# EAGLE design Keg Cop - Devel TH (EAGLE 9.6.2)
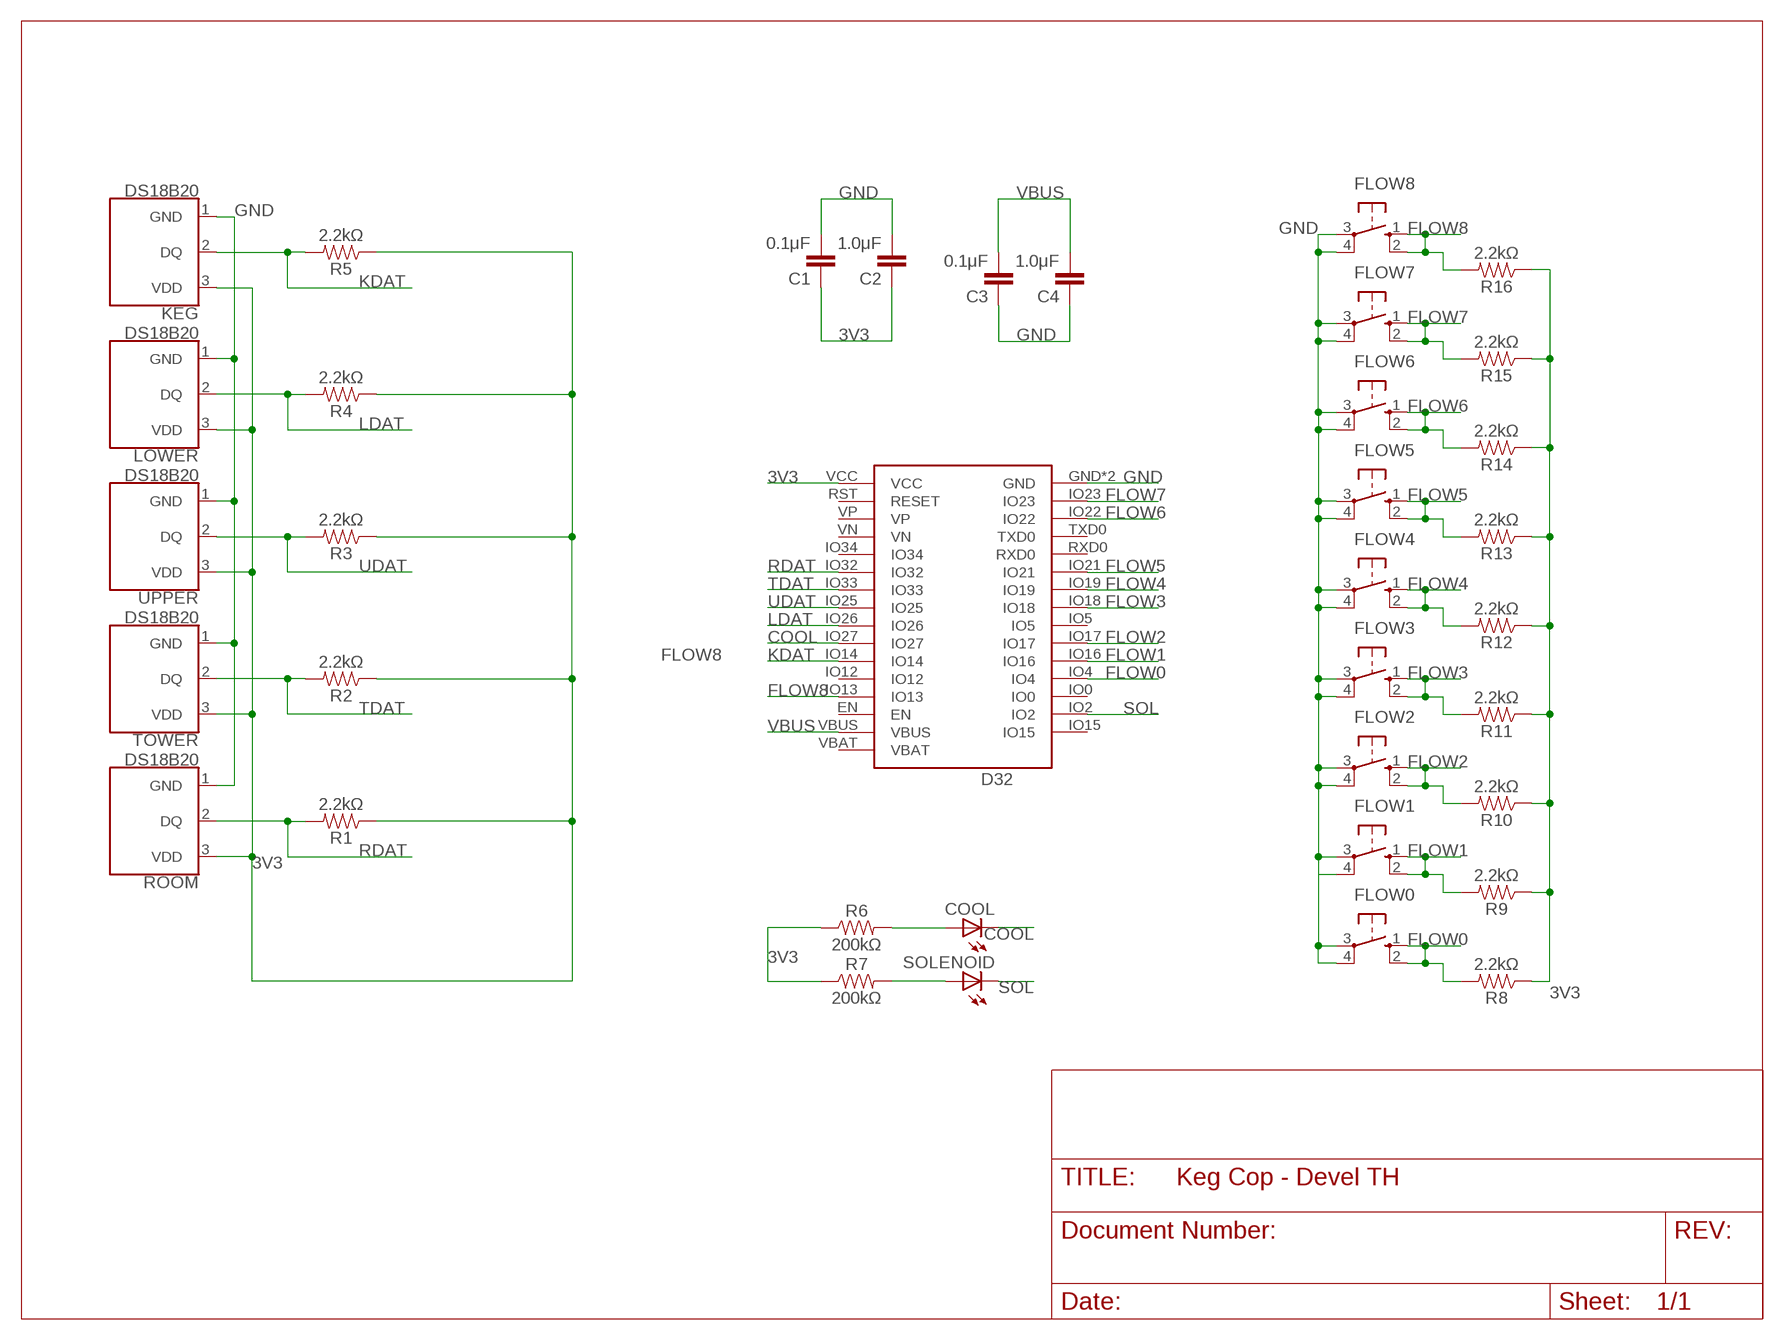
[diagram p0: schematic, sheet 1]

## Parts
C1  0.1μF  CAP_CERAMIC_2.54  [CAP_PTH-2.54]
C2  1.0μF  CAP_CERAMIC_2.54  [CAP_PTH-2.54]
C3  0.1μF  CAP_CERAMIC_2.54  [CAP_PTH-2.54]
C4  1.0μF  CAP_CERAMIC_2.54  [CAP_PTH-2.54]
COOL  LED3MM  [LED3MM]
D32  Lolin D32  WEMOS-D32D32_NO_BATT  [D32_NO_BATT]
FLOW0  10-XX  [B3F-10XX]
FLOW1  10-XX  [B3F-10XX]
FLOW2  10-XX  [B3F-10XX]
FLOW3  10-XX  [B3F-10XX]
FLOW4  10-XX  [B3F-10XX]
FLOW5  10-XX  [B3F-10XX]
FLOW6  10-XX  [B3F-10XX]
FLOW7  10-XX  [B3F-10XX]
FLOW8  10-XX  [B3F-10XX]
KEG  DS18B20  [TO-92-AMMO]
LOWER  DS18B20  [TO-92-AMMO]
R1  2.2kΩ  RESISTORAXIAL-0.3  [AXIAL-0.3]
R2  2.2kΩ  RESISTORAXIAL-0.3  [AXIAL-0.3]
R3  2.2kΩ  RESISTORAXIAL-0.3  [AXIAL-0.3]
R4  2.2kΩ  RESISTORAXIAL-0.3  [AXIAL-0.3]
R5  2.2kΩ  RESISTORAXIAL-0.3  [AXIAL-0.3]
R6  200kΩ  RESISTORAXIAL-0.3  [AXIAL-0.3]
R7  200kΩ  RESISTORAXIAL-0.3  [AXIAL-0.3]
R8  2.2kΩ  RESISTORAXIAL-0.3  [AXIAL-0.3]
R9  2.2kΩ  RESISTORAXIAL-0.3  [AXIAL-0.3]
R10  2.2kΩ  RESISTORAXIAL-0.3  [AXIAL-0.3]
R11  2.2kΩ  RESISTORAXIAL-0.3  [AXIAL-0.3]
R12  2.2kΩ  RESISTORAXIAL-0.3  [AXIAL-0.3]
R13  2.2kΩ  RESISTORAXIAL-0.3  [AXIAL-0.3]
R14  2.2kΩ  RESISTORAXIAL-0.3  [AXIAL-0.3]
R15  2.2kΩ  RESISTORAXIAL-0.3  [AXIAL-0.3]
R16  2.2kΩ  RESISTORAXIAL-0.3  [AXIAL-0.3]
ROOM  DS18B20  [TO-92-AMMO]
SOLENOID  LED3MM  [LED3MM]
TOWER  DS18B20  [TO-92-AMMO]
UPPER  DS18B20  [TO-92-AMMO]

## Nets
3V3 [3v]: C1.1 C2.1 D32.VCC KEG.3(VDD) LOWER.3(VDD) R1.P$1 R2.P$1 R3.P$1 R4.P$1 R5.P$1 R6.P$1 R7.P$1 R8.P$1 R9.P$1 R10.P$1 R11.P$1 R12.P$1 R13.P$1 R14.P$1 R15.P$1 R16.P$1 ROOM.3(VDD) TOWER.3(VDD) UPPER.3(VDD)
COOL: COOL.K(C) D32.IO27
FLOW0: D32.IO4 FLOW0.1(S) FLOW0.2(S1) R8.P$2
FLOW1: D32.IO16 FLOW1.1(S) FLOW1.2(S1) R9.P$2
FLOW2: D32.IO17 FLOW2.1(S) FLOW2.2(S1) R10.P$2
FLOW3: D32.IO18 FLOW3.1(S) FLOW3.2(S1) R11.P$2
FLOW4: D32.IO19 FLOW4.1(S) FLOW4.2(S1) R12.P$2
FLOW5: D32.IO21 FLOW5.1(S) FLOW5.2(S1) R13.P$2
FLOW6: D32.IO22 FLOW6.1(S) FLOW6.2(S1) R14.P$2
FLOW7: D32.IO23 FLOW7.1(S) FLOW7.2(S1) R15.P$2
FLOW8: D32.IO13 FLOW8.1(S) FLOW8.2(S1) R16.P$2
GND: C1.2 C2.2 C3.1 C4.1 D32.GND D32.GND2(GND) FLOW0.3(P) FLOW0.4(P1) FLOW1.3(P) FLOW1.4(P1) FLOW2.3(P) FLOW2.4(P1) FLOW3.3(P) FLOW3.4(P1) FLOW4.3(P) FLOW4.4(P1) FLOW5.3(P) FLOW5.4(P1) FLOW6.3(P) FLOW6.4(P1) FLOW7.3(P) FLOW7.4(P1) FLOW8.3(P) FLOW8.4(P1) KEG.1(GND) LOWER.1(GND) ROOM.1(GND) TOWER.1(GND) UPPER.1(GND)
KDAT: D32.IO14 KEG.2(DQ) R5.P$2
LDAT: D32.IO26 LOWER.2(DQ) R4.P$2
N$1: COOL.A R6.P$2
N$2: R7.P$2 SOLENOID.A
RDAT: D32.IO32 R1.P$2 ROOM.2(DQ)
SOL: D32.IO2 SOLENOID.K(C)
TDAT: D32.IO33 R2.P$2 TOWER.2(DQ)
UDAT: D32.IO25 R3.P$2 UPPER.2(DQ)
VBUS: C3.2 C4.2 D32.VBUS
Unconnected: D32.EN D32.IO0 D32.IO5 D32.IO12 D32.IO15 D32.IO34 D32.RST(RESET) D32.RXD0 D32.TXD0 D32.VBAT D32.VN D32.VP

## Library data of the parts
C1-C4 = Donnie:CAP_CERAMIC_2.54
COOL SOLENOID = adafruit:LED: LED OSRAM: - CHIPLED LG R971, LG N971, LY N971, LG Q971, LY Q971, LO R971, LY R971 LH N974, LH R974 LS Q976, LO Q976, LY Q976 LO Q996 - Hyper CHIPLED LW Q18S LB Q993, LB Q99A, LB R99A - SideLED LS A670, LO A670, LY A670, LG A670, LP A670 LB A673, LV A673, LT A673, LW A673 LH A674 LY A675 LS A676, LA A676, LO A676, LY A676, LW A676 LS A679, LY A679, LG A679 - Hyper Micro SIDELED® LS Y876, LA Y876, LO Y876, LY Y876 LT Y87S - SmartLED LW L88C, LW L88S LB L89C, LB L89S, LG L890 LS L89K, LO L89K, LY L89K LS L896, LA L896, LO L896, LY L896 - TOPLED LS T670, LO T670, LY T670, LG T670, LP T670 LSG T670, LSP T670, LSY T670, LOP T670, LYG T670 LG T671, LOG T671, LSG T671 LB T673, LV T673, LT T673, LW T673 LH T674 LS T676, LA T676, LO T676, LY T676, LB T676, LH T676, LSB T676, LW T676 LB T67C, LV T67C, LT T67C, LS T67K, LO T67K, LY T67K, LW E67C LS E67B, LA E67B, LO E67B, LY E67B, LB E67C, LV E67C, LT E67C LW T67C LS T679, LY T679, LG T679 LS T770, LO T770, LY T770, LG T770, LP T770 LB T773, LV T773, LT T773, LW T773 LH T774 LS E675, LA E675, LY E675, LS T675 LS T776, LA T776, LO T776, LY T776, LB T776 LHGB T686 LT T68C, LB T68C - Hyper Mini TOPLED® LB M676 - Mini TOPLED Santana® LG M470 LS M47K, LO M47K, LY M47K Source: http://www.osram.convergy.de/
D32 = Donnie:WEMOS-D32: D32_REVERSE is a Reverse silkscreen for placing the Wemos D32 on the underside of the board D32_NO-KEEPOUT removes the keepout area beneath the antenna on the D32 and provides a note to avoid components and traces.; SPICEPREFIX: X
FLOW0 FLOW1-FLOW8 = switch-omron:10-XX: OMRON SWITCH; MPN: B3F-1000; OC_FARNELL: 176432; OC_NEWARK: 36M3542
KEG LOWER ROOM TOWER UPPER = SparkFun-Sensors:DS18B20: Dallas/Maxim DS18B20 1-Wire Temperature Sensor The DS18B20 reports degrees C with 9 to 12-bit precision, -55C to 125C (+/-0.5C). Each sensor has a unique 64-Bit Serial number etched into it - allows for a huge number of sensors to be used on one data bus. Datasheet <http://datasheets.maximintegrated.com/en/ds/DS18B20.pdf> SparkFun Products One Wire Digital Temperature Sensor - DS18B20 <https://www.sparkfun.com/products/245> (SEN-00245); STORE_ID: SEN-00245
R1-R16 = SparkFun-Resistors:RESISTOR: Generic Resistor Package

## Net classes
0 default: width 0.305 mm, clearance 0.305 mm
1 5v: width 0.406 mm, clearance 0.406 mm
2 3v: width 0.406 mm, clearance 0.406 mm

## Board
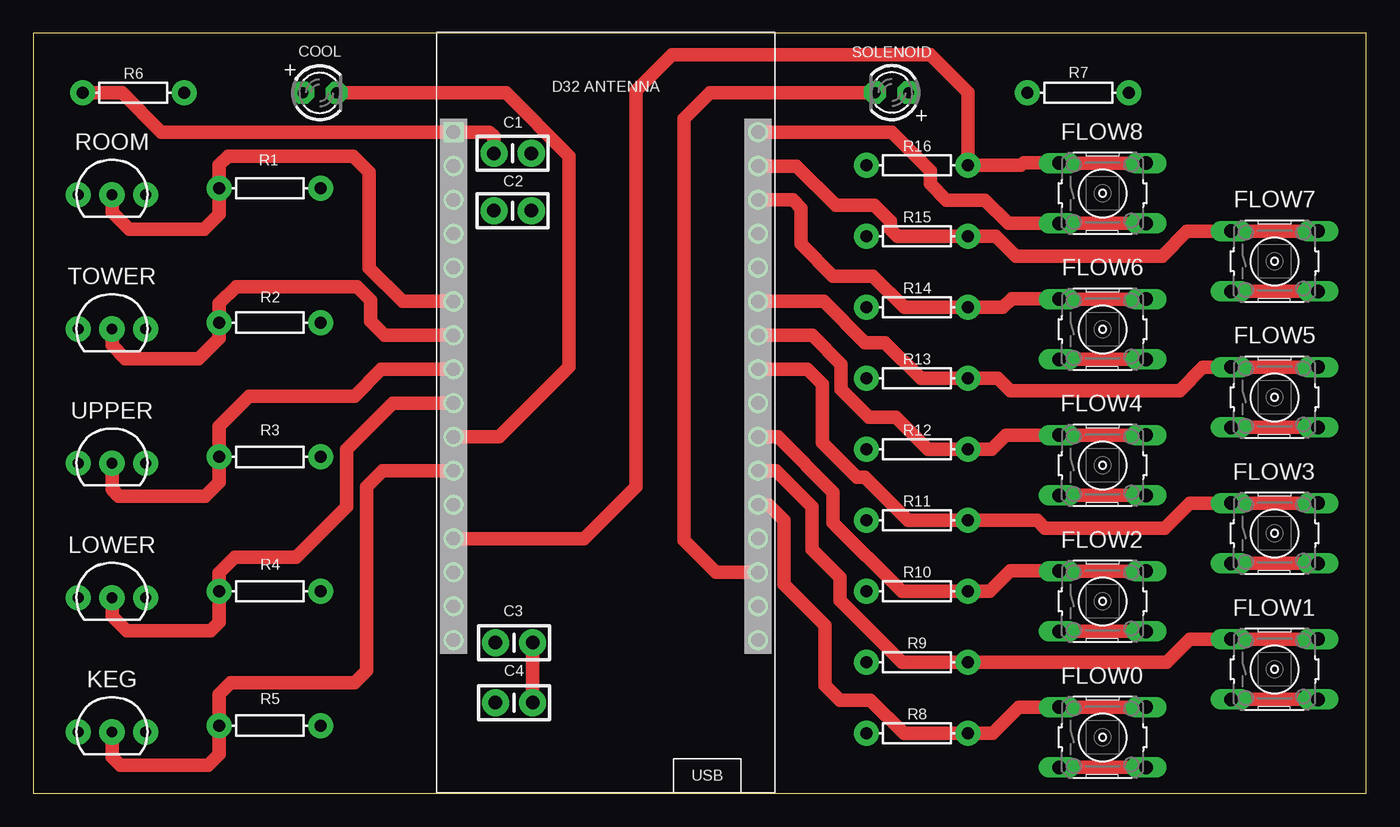
[diagram p1: board, top side]
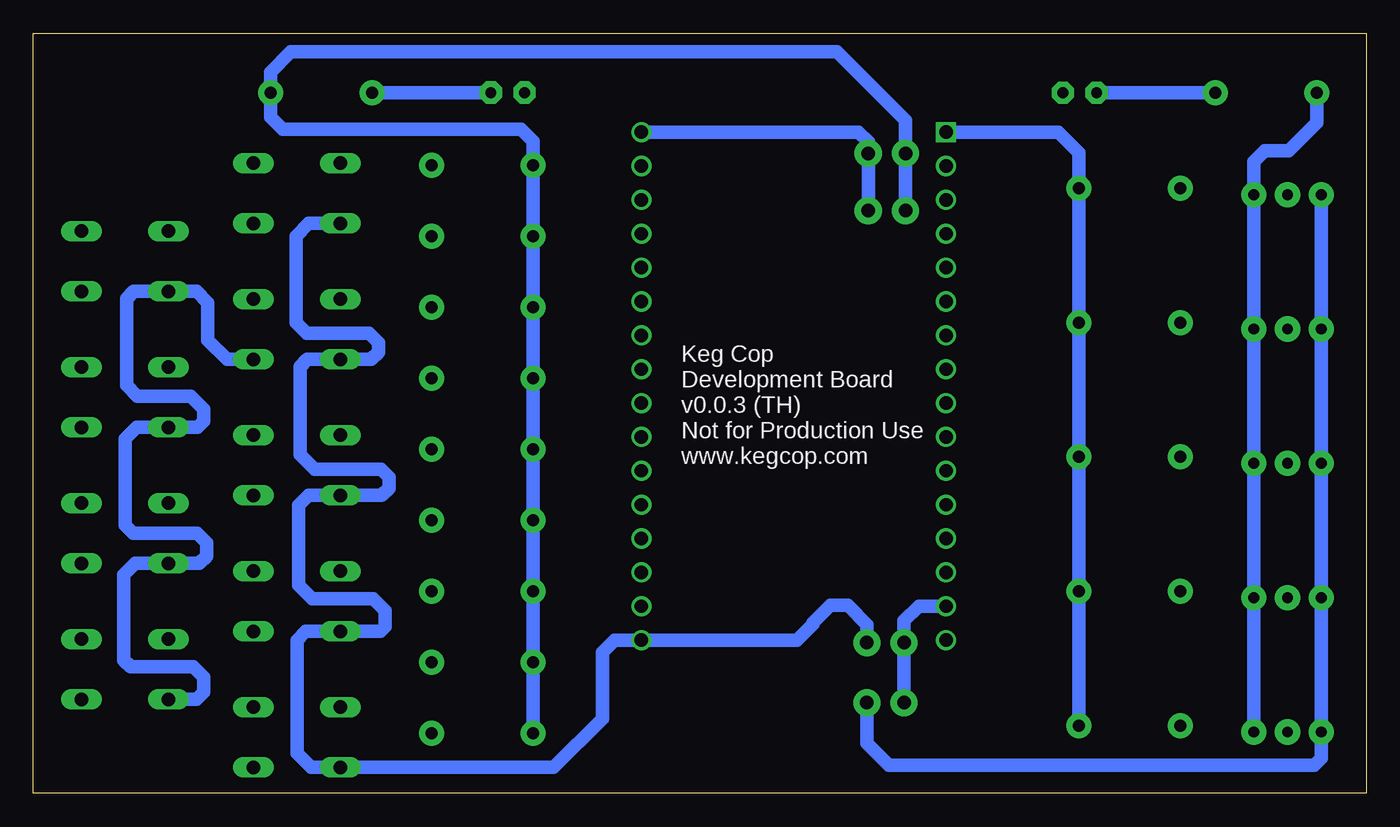
[diagram p2: board, bottom side, seen from below]

Size 100 x 57 mm. Coordinates in mm from the lower left corner, seen from the top.
Outline: 0,0 100,0 100,57 0,57 0,0
Copper layers (1*16): Top 0.035mm / dielectric 1.5mm / Bottom 0.035mm
Design rules "default *": minimum track width 6mil, minimum drill 0.35mm, track to track 6mil, track to pad 6mil, pad to pad 6mil, via to via 6mil, smd to smd 6mil, copper to edge 20mil, drill to drill 6mil, minimum pad ring 10mil, minimum via ring 8mil, stop-mask expansion 4mil, vias tented up to drill 20mil, thermal gap 10mil

### Footprints (pad centres in the part's own frame; a part is rotated, then mirrored left to right if it is on the bottom)
CAP_PTH-2.54 = drill 1.016 pad 2.032: 1 -1.397,0; 2 1.397,0
LED3MM = drill 0.813 pad 1.676 octagon: A -1.27,0; K 1.27,0
D32_NO_BATT = drill 1: EN -11.43,-12.7; GND 11.43,20.32; GND2 11.43,-17.78; IO0 11.43,-10.16; IO2 11.43,-12.7; IO4 11.43,-7.62; IO5 11.43,0; IO12 -11.43,-7.62; IO13 -11.43,-10.16; IO14 -11.43,-5.08; IO15 11.43,-15.24; IO16 11.43,-5.08; IO17 11.43,-2.54; IO18 11.43,2.54; IO19 11.43,5.08; IO21 11.43,7.62; IO22 11.43,15.24; IO23 11.43,17.78; IO25 -11.43,2.54; IO26 -11.43,0; IO27 -11.43,-2.54; IO32 -11.43,7.62; IO33 -11.43,5.08; IO34 -11.43,10.16; RST -11.43,17.78; RXD0 11.43,10.16; TXD0 11.43,12.7; VBAT -11.43,-17.78; VBUS -11.43,-15.24; VN -11.43,12.7; VP -11.43,15.24 | drill 1 square: VCC -11.43,20.32
B3F-10XX = drill 1.016 long: 1 -3.251,2.261; 2 3.251,2.261; 3 -3.251,-2.261; 4 3.251,-2.261
TO-92-AMMO = drill 0.813 pad 1.88: 1 -2.54,0; 2 0,0; 3 2.54,0
AXIAL-0.3 = drill 0.9 pad 1.88: P$1 -3.81,0; P$2 3.81,0

### Placement (x,y rotation side)
C1  35.96,48 0 top
C2  35.96,43.7 0 top
C3  36.06,11.3 180 top
C4  36.06,6.8 180 top
COOL  21.49,52.54 0 top
D32  42.95,29.27 0 top
FLOW0  80.22,4.2 0 top
FLOW1  93.12,9.3 0 top
FLOW2  80.22,14.4 0 top
FLOW3  93.12,19.5 0 top
FLOW4  80.22,24.6 0 top
FLOW5  93.12,29.7 0 top
FLOW6  80.22,34.8 0 top
FLOW7  93.12,39.9 0 top
FLOW8  80.22,45 0 top
KEG  5.9,4.6 0 top
LOWER  5.9,14.68 0 top
R1  17.75,45.38 180 top
R2  17.75,35.3 180 top
R3  17.75,25.23 180 top
R4  17.75,15.15 180 top
R5  17.75,5.08 180 top
R6  7.5,52.55 0 top
R7  78.4,52.55 180 top
R8  66.3,4.5 0 top
R9  66.3,9.82 0 top
R10  66.3,15.15 0 top
R11  66.3,20.48 0 top
R12  66.3,25.8 0 top
R13  66.3,31.12 0 top
R14  66.3,36.45 0 top
R15  66.3,41.77 0 top
R16  66.3,47.1 0 top
ROOM  5.9,44.9 0 top
SOLENOID  64.41,52.56 180 top
TOWER  5.9,34.83 0 top
UPPER  5.9,24.75 0 top

### Tracks (layer width: path | path; a pad name or v marks a point on that pad's centre or on a via)
3V3
  Top 1.016: R6.P$1 6.65,52.55 9.61,49.59 D32.VCC 34.21,49.59 34.57,49.23 C1.1
  Bottom 1.016: KEG.3 LOWER.3 UPPER.3 TOWER.3 ROOM.3 8.44,47.36 7.6,48.2 5.8,48.2 3.69,50.31 R6.P$1 | R5.P$1 R4.P$1 R3.P$1 R2.P$1 R1.P$1 21.56,48.06 23.09,49.59 D32.VCC | R8.P$1 R9.P$1 R10.P$1 R11.P$1 R12.P$1 R13.P$1 R14.P$1 R15.P$1 R16.P$1 62.49,48.89 63.4,49.8 81.3,49.8 82.21,50.71 R7.P$1 82.21,54.09 80.7,55.6 39.7,55.6 34.57,50.47 C1.1 C2.1
COOL
  Top 1.016: D32.IO27 34.93,26.73 40.2,32 40.2,47.8 35.46,52.54 COOL.K
FLOW0
  Top 1.016: D32.IO4 55.15,21.65 56.3,20.5 56.3,15.7 59.4,12.6 59.4,8.1 60.5,7 62.8,7 65.3,4.5 R8.P$2 72,4.5 73.96,6.46 FLOW0.1 FLOW0.2
FLOW1
  Top 1.016: D32.IO16 55.71,24.19 58.4,21.5 58.4,18.3 60.5,16.2 60.5,14.5 65.17,9.82 R9.P$2 85.03,9.82 86.76,11.56 FLOW1.1 FLOW1.2
FLOW2
  Top 1.016: D32.IO17 55.86,26.73 60,22.59 60,20.3 65.15,15.15 R10.P$2 71.75,15.15 73.3,16.7 76.93,16.7 FLOW2.1 FLOW2.2
FLOW3
  Top 1.016: D32.IO18 58.09,31.81 59.2,30.7 59.2,26.3 61.8,23.7 62.4,23.7 65.62,20.48 R11.P$2 75.33,20.48 75.9,19.9 84.9,19.9 86.76,21.76 FLOW3.1 FLOW3.2
FLOW4
  Top 1.016: D32.IO19 58.45,34.35 60.6,32.2 60.6,30.3 62.7,28.2 64.7,28.2 67.1,25.8 R12.P$2 71.9,25.8 72.96,26.86 FLOW4.1 FLOW4.2
FLOW5
  Top 1.016: D32.IO21 59.31,36.89 62.4,33.8 63.9,33.8 66.58,31.12 R13.P$2 72.38,31.12 73.3,30.2 86,30.2 87.76,31.96 FLOW5.1 FLOW5.2
FLOW6
  Top 1.016: D32.IO22 56.99,44.51 57.6,43.9 57.6,41.2 60,38.8 63,38.8 65.35,36.45 R14.P$2 72.75,36.45 73.4,37.1 76.93,37.1 FLOW6.1 FLOW6.2
FLOW7
  Top 1.016: D32.IO23 57.25,47.05 60.2,44.1 63.1,44.1 64.3,42.9 64.3,42.3 64.83,41.77 R15.P$2 72.22,41.77 73.7,40.3 84.7,40.3 86.56,42.16 FLOW7.1 FLOW7.2
FLOW8
  Top 1.016: D32.IO13 41.31,19.11 45.2,23 45.2,52.7 47.9,55.4 67.3,55.4 70.11,52.59 R16.P$2 74.1,47.1 74.3,47.3 76.93,47.3 FLOW8.1 FLOW8.2
GND
  Top 1.016: FLOW8.4 FLOW8.3 73.16,42.74 71.4,44.5 68.5,44.5 67.3,45.7 67.3,46.7 64.41,49.59 D32.GND | FLOW6.3 FLOW6.4 | FLOW4.3 FLOW4.4 | FLOW2.3 FLOW2.4 | FLOW0.3 FLOW0.4 | FLOW1.3 FLOW1.4 | FLOW3.3 FLOW3.4 | FLOW5.3 FLOW5.4 | FLOW7.3 FLOW7.4 | C4.1 C3.1
  Bottom 1.016: ROOM.1 TOWER.1 UPPER.1 LOWER.1 KEG.1 3.36,2.64 3.9,2.1 34.4,2.1 35.8,2.1 37.46,3.76 C4.1 | FLOW8.3 79.36,42.74 80.3,41.8 80.3,35.3 79.5,34.5 74.8,34.5 74.1,33.8 74.1,33.1 74.66,32.54 FLOW6.3 79.46,32.54 80,32 80,25.4 78.9,24.3 73.9,24.3 73.3,23.7 73.3,22.9 73.86,22.34 FLOW4.3 79.36,22.34 80.1,21.6 80.1,15.6 79.1,14.6 74.5,14.6 73.6,13.7 73.6,12.5 73.96,12.14 FLOW2.3 79.56,12.14 80.2,11.5 80.2,3 79.14,1.94 FLOW0.3 60.96,1.94 57.3,5.6 57.3,10.6 56.41,11.49 D32.GND2 42.71,11.49 41.5,12.7 41.5,12.8 40.2,14.1 38.9,14.1 37.46,12.66 C3.1 | FLOW1.3 87.76,7.04 87.2,7.6 87.2,8.7 88,9.5 92.7,9.5 93.2,10 93.2,16.4 92.36,17.24 FLOW3.3 87.56,17.24 87,17.8 87,18.8 87.7,19.5 92.5,19.5 93.1,20.1 93.1,26.6 92.26,27.44 FLOW5.3 87.66,27.44 87.2,27.9 87.2,28.8 88.2,29.8 92.2,29.8 93,30.6 93,37.1 92.46,37.64 FLOW7.3 87.74,37.64 86.9,36.8 86.9,34 85.44,32.54 FLOW6.4 | C2.2 C1.2 37.36,48.86 38.09,49.59 40.79,49.59 D32.GND
KDAT
  Top 1.016: KEG.2 5.9,2.7 6.5,2.1 13.1,2.1 13.94,2.94 R5.P$2 13.94,7.44 14.8,8.3 24.1,8.3 25,9.2 25,23 26.19,24.19 D32.IO14
LDAT
  Top 1.016: LOWER.2 5.9,13.3 7,12.2 13.3,12.2 13.94,12.84 R4.P$2 13.94,16.54 15.1,17.7 19.7,17.7 23.5,21.5 23.5,25.8 26.97,29.27 D32.IO26
N$1
  Bottom 1.016: R6.P$2 COOL.A
N$2
  Bottom 1.016: SOLENOID.A R7.P$2
RDAT
  Top 1.016: ROOM.2 5.9,43.6 7.2,42.3 12.8,42.3 13.94,43.44 R1.P$2 13.94,47.14 14.6,47.8 24,47.8 25.2,46.6 25.2,39.4 27.71,36.89 D32.IO32
SOL
  Top 1.016: D32.IO2 51.23,16.57 48.8,19 48.8,50.6 50.76,52.56 SOLENOID.K
TDAT
  Top 1.016: TOWER.2 5.9,33.6 6.9,32.6 12.4,32.6 13.94,34.14 R2.P$2 13.94,36.74 15.2,38 24.3,38 25.3,37 25.3,35.4 26.35,34.35 D32.IO33
UDAT
  Top 1.016: UPPER.2 5.9,22.8 6.4,22.3 12.9,22.3 13.94,23.34 R3.P$2 13.94,27.54 16.2,29.8 24.1,29.8 26.11,31.81 D32.IO25
VBUS
  Bottom 1.016: D32.VBUS 33.57,14.03 34.67,12.93 C3.2 C4.2

### Text on the board
bNames: Keg Cop / Development Board / v0.0.3 (TH) / Not for Production Use / www.kegcop.com